# EAGLE board magarray_v1 (EAGLE 6.5.0), part 1 of 3
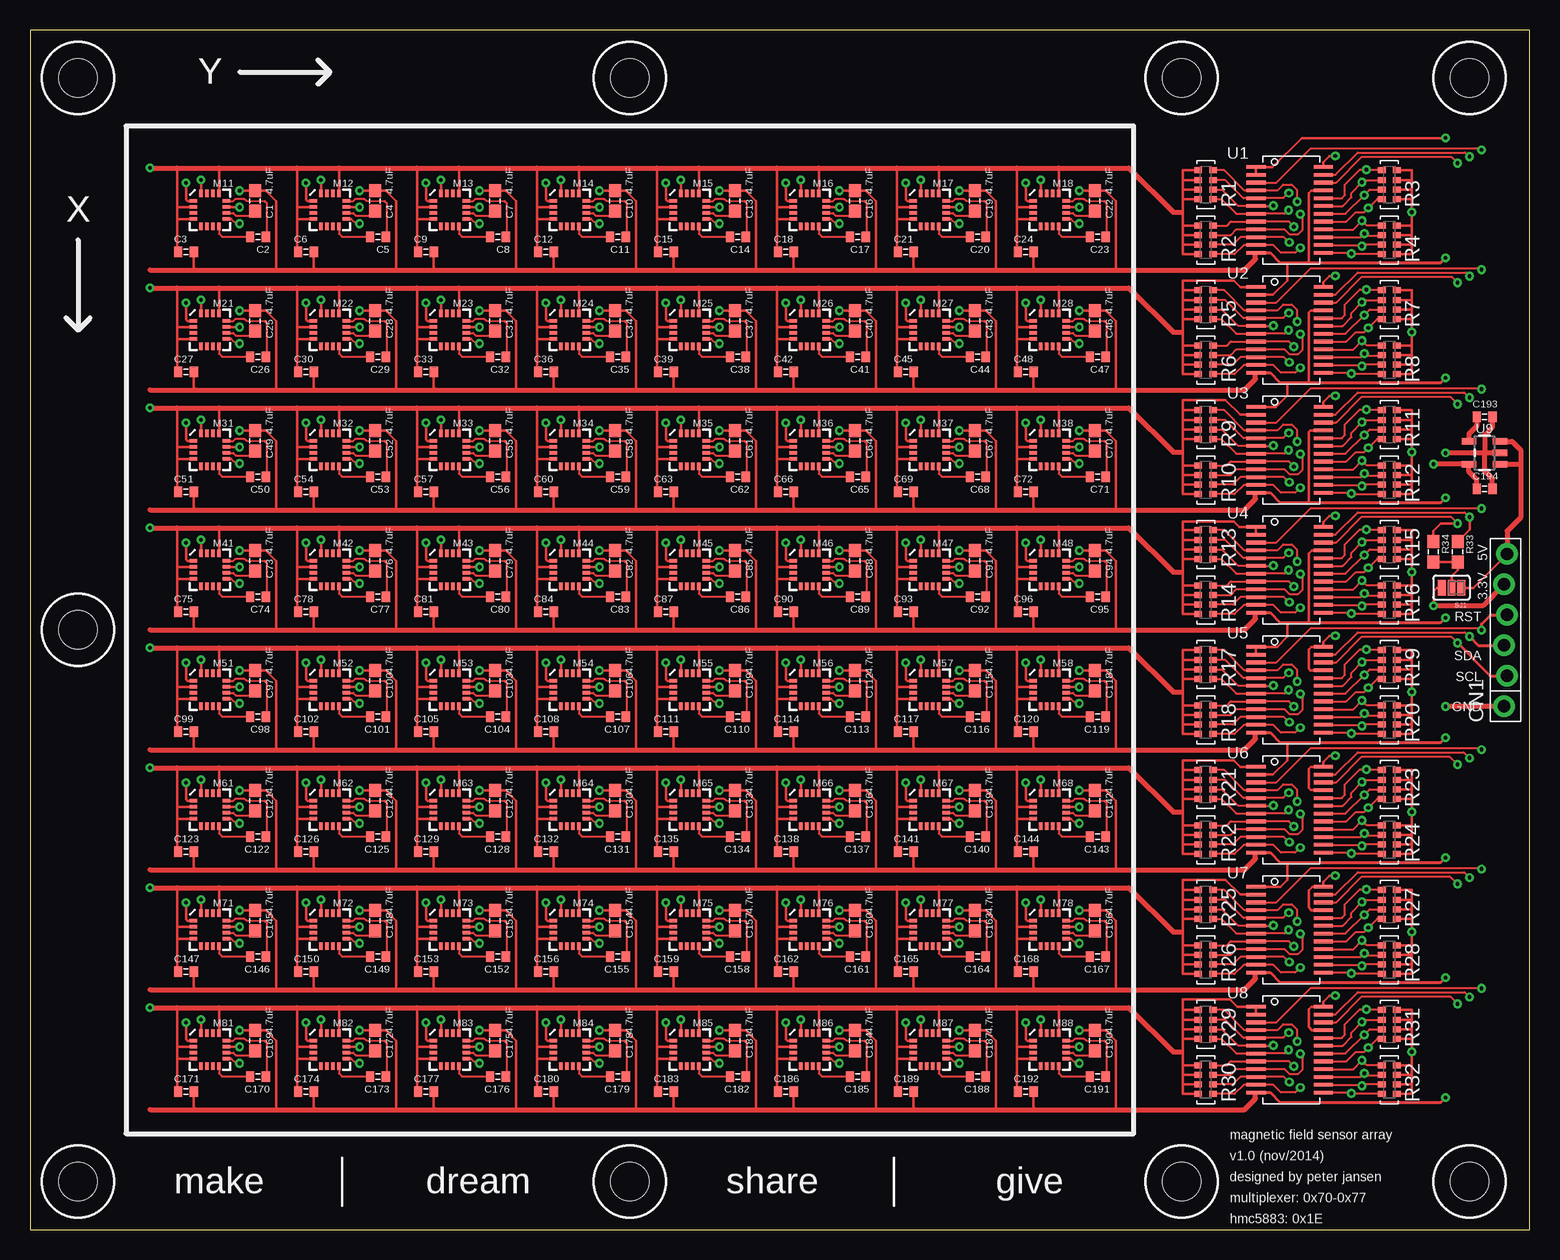
[diagram p5: board, top side]
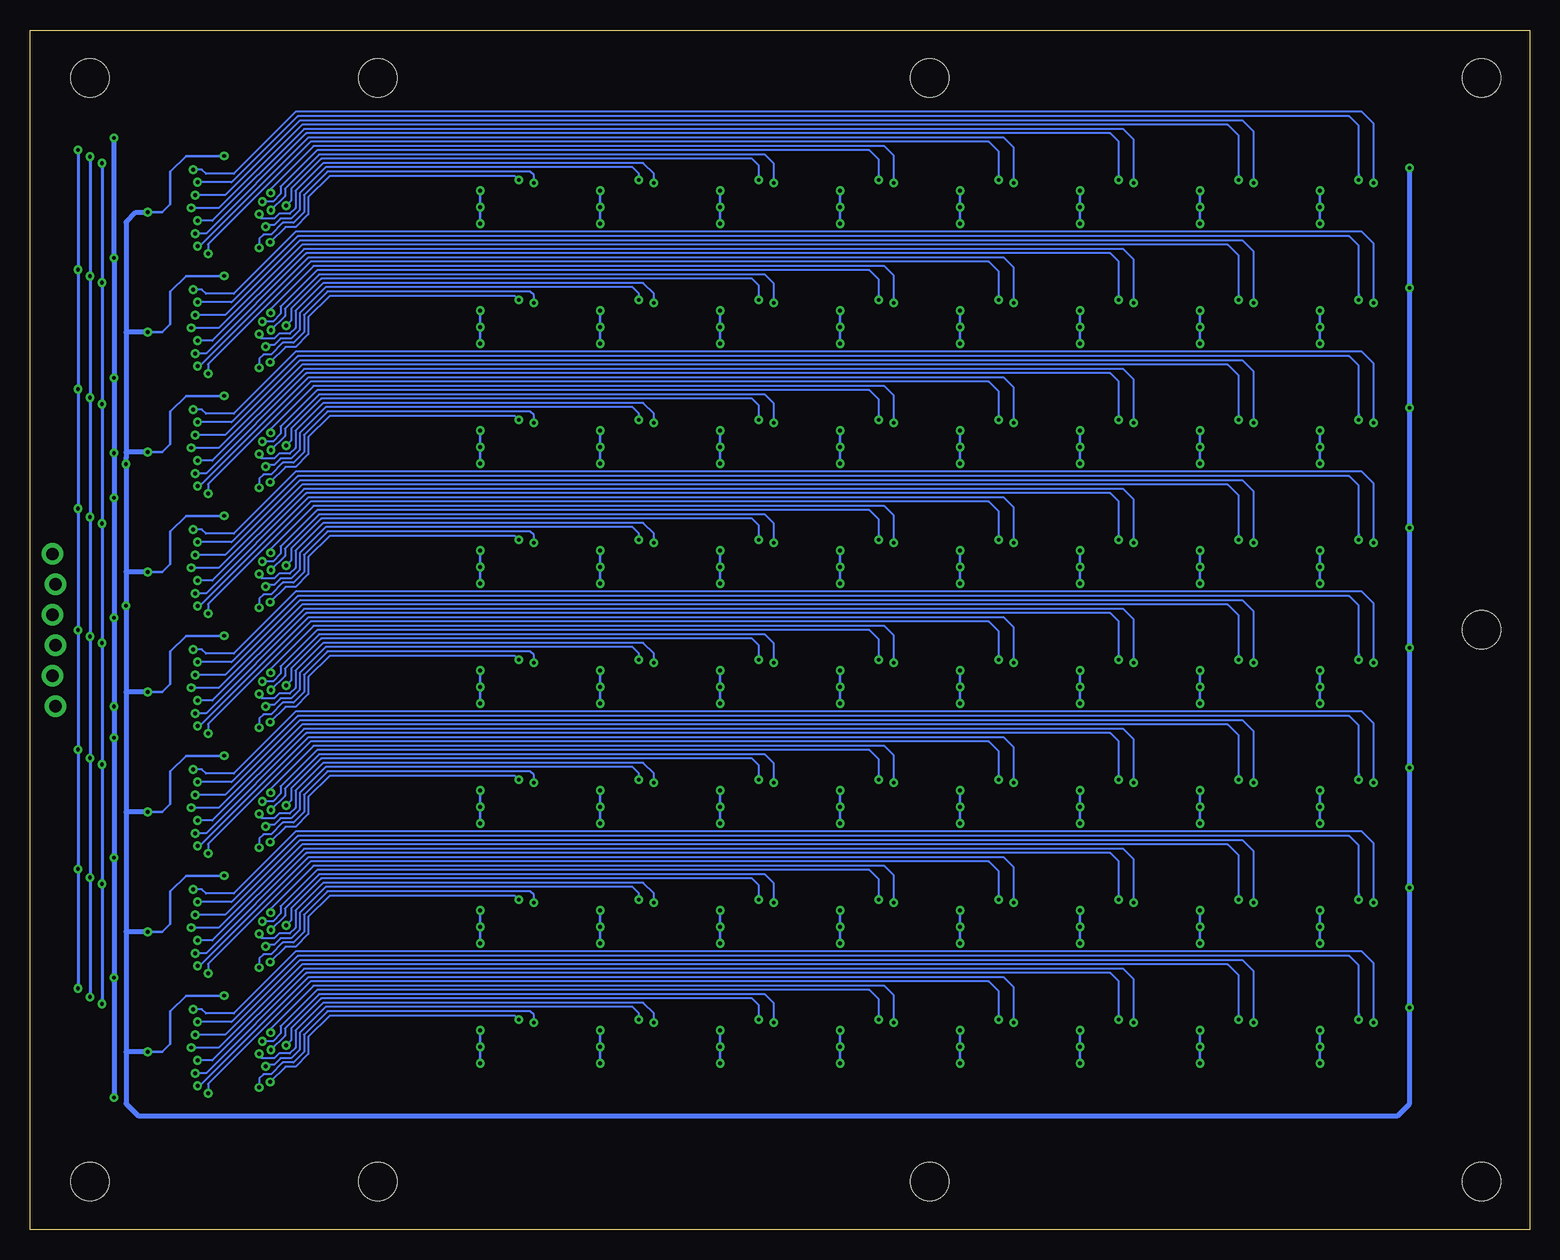
[diagram p6: board, bottom side, seen from below]

Size 125 x 100 mm. Coordinates in mm from the lower left corner, seen from the top.
Outline: 0,0 125,0 125,100 0,100 0,0
Copper layers (1*16): Top 0.035mm / dielectric 1.5mm / Bottom 0.035mm
Design rules "default *": minimum track width 7mil, minimum drill 13mil, track to track 7mil, track to pad 7mil, pad to pad 7mil, via to via 7mil, smd to smd 7mil, copper to edge 20mil, drill to drill 8mil, minimum pad ring 10mil, minimum via ring 8mil, stop-mask expansion 4mil, vias tented up to drill 13mil, thermal gap 10mil
Holes 3.2 mm at 4,96 4,4 96,4 96,96 120,96 120,4 4,50 50,4 50,96

## Footprints (pad centres in the part's own frame; a part is rotated, then mirrored left to right if it is on the bottom)
0603 = smd 1.1 x 1: 1 -0.85,0; 2 0.85,0
C0402 = smd 0.7 x 0.9: 1 -0.65,0; 2 0.65,0
1X06 = drill 1.016 pad 1.778: 1 0,0.127; 2 2.54,-0.127; 3 5.08,0.127; 4 7.62,-0.127; 5 10.16,0.127; 6 12.7,-0.127
16LPCC = smd 0.65 x 0.28: 1 -1.37,0.75; 2 -1.37,0.25; 3 -1.37,-0.25; 4 -1.37,-0.75; 9 1.37,-0.75; 10 1.37,-0.25; 11 1.37,0.25; 12 1.37,0.75 | smd 0.28 x 0.65: 5 -0.75,-1.37; 6 -0.25,-1.37; 7 0.25,-1.37; 8 0.75,-1.37; 13 0.75,1.37; 14 0.25,1.37; 15 -0.25,1.37; 16 -0.75,1.37
0603-ARV = smd 0.5 x 0.65: 1 -1.2,-0.625; 2 -0.4,-0.625; 3 0.4,-0.625; 4 1.2,-0.625; 5 1.2,0.625; 6 0.4,0.625; 7 -0.4,0.625; 8 -1.2,0.625
SJ_3_PASTE1&2 = smd 0.635 x 1.27: 1 -0.813,0; 2 0,0; 3 0.813,0
TSSOP-24-4.4MM = smd 0.3 x 1.6: 1 -3.575,-2.8; 2 -2.925,-2.8; 3 -2.275,-2.8; 4 -1.625,-2.8; 5 -0.975,-2.8; 6 -0.325,-2.8; 7 0.325,-2.8; 8 0.975,-2.8; 9 1.625,-2.8; 10 2.275,-2.8; 11 2.925,-2.8; 12 3.575,-2.8; 13 3.575,2.8; 14 2.925,2.8; 15 2.275,2.8; 16 1.625,2.8; 17 0.975,2.8; 18 0.325,2.8; 19 -0.325,2.8; 20 -0.975,2.8; 21 -1.625,2.8; 22 -2.275,2.8; 23 -2.925,2.8; 24 -3.575,2.8
SOT23-5 = smd 0.55 x 1.2: 1 -0.95,-1.3; 2 0,-1.3; 3 0.95,-1.3; 4 0.95,1.3; 5 -0.95,1.3

## Placement (x,y rotation side)
C1  4.7uF  [0603]  18.75,85.75 90 top
C2  0.22uF  [C0402]  19,82.75 180 top
C3  0.1uF  [C0402]  13,81.5 0 top
C4  4.7uF  [0603]  28.75,85.75 90 top
C5  0.22uF  [C0402]  29,82.75 180 top
C6  0.1uF  [C0402]  23,81.5 0 top
C7  4.7uF  [0603]  38.75,85.75 90 top
C8  0.22uF  [C0402]  39,82.75 180 top
C9  0.1uF  [C0402]  33,81.5 0 top
C10  4.7uF  [0603]  48.75,85.75 90 top
C11  0.22uF  [C0402]  49,82.75 180 top
C12  0.1uF  [C0402]  43,81.5 0 top
C13  4.7uF  [0603]  58.75,85.75 90 top
C14  0.22uF  [C0402]  59,82.75 180 top
C15  0.1uF  [C0402]  53,81.5 0 top
C16  4.7uF  [0603]  68.75,85.75 90 top
C17  0.22uF  [C0402]  69,82.75 180 top
C18  0.1uF  [C0402]  63,81.5 0 top
C19  4.7uF  [0603]  78.75,85.75 90 top
C20  0.22uF  [C0402]  79,82.75 180 top
C21  0.1uF  [C0402]  73,81.5 0 top
C22  4.7uF  [0603]  88.75,85.75 90 top
C23  0.22uF  [C0402]  89,82.75 180 top
C24  0.1uF  [C0402]  83,81.5 0 top
C25  4.7uF  [0603]  18.75,75.75 90 top
C26  0.22uF  [C0402]  19,72.75 180 top
C27  0.1uF  [C0402]  13,71.5 0 top
C28  4.7uF  [0603]  28.75,75.75 90 top
C29  0.22uF  [C0402]  29,72.75 180 top
C30  0.1uF  [C0402]  23,71.5 0 top
C31  4.7uF  [0603]  38.75,75.75 90 top
C32  0.22uF  [C0402]  39,72.75 180 top
C33  0.1uF  [C0402]  33,71.5 0 top
C34  4.7uF  [0603]  48.75,75.75 90 top
C35  0.22uF  [C0402]  49,72.75 180 top
C36  0.1uF  [C0402]  43,71.5 0 top
C37  4.7uF  [0603]  58.75,75.75 90 top
C38  0.22uF  [C0402]  59,72.75 180 top
C39  0.1uF  [C0402]  53,71.5 0 top
C40  4.7uF  [0603]  68.75,75.75 90 top
C41  0.22uF  [C0402]  69,72.75 180 top
C42  0.1uF  [C0402]  63,71.5 0 top
C43  4.7uF  [0603]  78.75,75.75 90 top
C44  0.22uF  [C0402]  79,72.75 180 top
C45  0.1uF  [C0402]  73,71.5 0 top
C46  4.7uF  [0603]  88.75,75.75 90 top
C47  0.22uF  [C0402]  89,72.75 180 top
C48  0.1uF  [C0402]  83,71.5 0 top
C49  4.7uF  [0603]  18.75,65.75 90 top
C50  0.22uF  [C0402]  19,62.75 180 top
C51  0.1uF  [C0402]  13,61.5 0 top
C52  4.7uF  [0603]  28.75,65.75 90 top
C53  0.22uF  [C0402]  29,62.75 180 top
C54  0.1uF  [C0402]  23,61.5 0 top
C55  4.7uF  [0603]  38.75,65.75 90 top
C56  0.22uF  [C0402]  39,62.75 180 top
C57  0.1uF  [C0402]  33,61.5 0 top
C58  4.7uF  [0603]  48.75,65.75 90 top
C59  0.22uF  [C0402]  49,62.75 180 top
C60  0.1uF  [C0402]  43,61.5 0 top
C61  4.7uF  [0603]  58.75,65.75 90 top
C62  0.22uF  [C0402]  59,62.75 180 top
C63  0.1uF  [C0402]  53,61.5 0 top
C64  4.7uF  [0603]  68.75,65.75 90 top
C65  0.22uF  [C0402]  69,62.75 180 top
C66  0.1uF  [C0402]  63,61.5 0 top
C67  4.7uF  [0603]  78.75,65.75 90 top
C68  0.22uF  [C0402]  79,62.75 180 top
C69  0.1uF  [C0402]  73,61.5 0 top
C70  4.7uF  [0603]  88.75,65.75 90 top
C71  0.22uF  [C0402]  89,62.75 180 top
C72  0.1uF  [C0402]  83,61.5 0 top
C73  4.7uF  [0603]  18.75,55.75 90 top
C74  0.22uF  [C0402]  19,52.75 180 top
C75  0.1uF  [C0402]  13,51.5 0 top
C76  4.7uF  [0603]  28.75,55.75 90 top
C77  0.22uF  [C0402]  29,52.75 180 top
C78  0.1uF  [C0402]  23,51.5 0 top
C79  4.7uF  [0603]  38.75,55.75 90 top
C80  0.22uF  [C0402]  39,52.75 180 top
C81  0.1uF  [C0402]  33,51.5 0 top
C82  4.7uF  [0603]  48.75,55.75 90 top
C83  0.22uF  [C0402]  49,52.75 180 top
C84  0.1uF  [C0402]  43,51.5 0 top
C85  4.7uF  [0603]  58.75,55.75 90 top
C86  0.22uF  [C0402]  59,52.75 180 top
C87  0.1uF  [C0402]  53,51.5 0 top
C88  4.7uF  [0603]  68.75,55.75 90 top
C89  0.22uF  [C0402]  69,52.75 180 top
C90  0.1uF  [C0402]  63,51.5 0 top
C91  4.7uF  [0603]  78.75,55.75 90 top
C92  0.22uF  [C0402]  79,52.75 180 top
C93  0.1uF  [C0402]  73,51.5 0 top
C94  4.7uF  [0603]  88.75,55.75 90 top
C95  0.22uF  [C0402]  89,52.75 180 top
C96  0.1uF  [C0402]  83,51.5 0 top
C97  4.7uF  [0603]  18.75,45.75 90 top
C98  0.22uF  [C0402]  19,42.75 180 top
C99  0.1uF  [C0402]  13,41.5 0 top
C100  4.7uF  [0603]  28.75,45.75 90 top
C101  0.22uF  [C0402]  29,42.75 180 top
C102  0.1uF  [C0402]  23,41.5 0 top
C103  4.7uF  [0603]  38.75,45.75 90 top
C104  0.22uF  [C0402]  39,42.75 180 top
C105  0.1uF  [C0402]  33,41.5 0 top
C106  4.7uF  [0603]  48.75,45.75 90 top
C107  0.22uF  [C0402]  49,42.75 180 top
C108  0.1uF  [C0402]  43,41.5 0 top
C109  4.7uF  [0603]  58.75,45.75 90 top
C110  0.22uF  [C0402]  59,42.75 180 top
C111  0.1uF  [C0402]  53,41.5 0 top
C112  4.7uF  [0603]  68.75,45.75 90 top
C113  0.22uF  [C0402]  69,42.75 180 top
C114  0.1uF  [C0402]  63,41.5 0 top
C115  4.7uF  [0603]  78.75,45.75 90 top
C116  0.22uF  [C0402]  79,42.75 180 top
C117  0.1uF  [C0402]  73,41.5 0 top
C118  4.7uF  [0603]  88.75,45.75 90 top
C119  0.22uF  [C0402]  89,42.75 180 top
C120  0.1uF  [C0402]  83,41.5 0 top
C121  4.7uF  [0603]  18.75,35.75 90 top
C122  0.22uF  [C0402]  19,32.75 180 top
C123  0.1uF  [C0402]  13,31.5 0 top
C124  4.7uF  [0603]  28.75,35.75 90 top
C125  0.22uF  [C0402]  29,32.75 180 top
C126  0.1uF  [C0402]  23,31.5 0 top
C127  4.7uF  [0603]  38.75,35.75 90 top
C128  0.22uF  [C0402]  39,32.75 180 top
C129  0.1uF  [C0402]  33,31.5 0 top
C130  4.7uF  [0603]  48.75,35.75 90 top
C131  0.22uF  [C0402]  49,32.75 180 top
C132  0.1uF  [C0402]  43,31.5 0 top
C133  4.7uF  [0603]  58.75,35.75 90 top
C134  0.22uF  [C0402]  59,32.75 180 top
C135  0.1uF  [C0402]  53,31.5 0 top
C136  4.7uF  [0603]  68.75,35.75 90 top
C137  0.22uF  [C0402]  69,32.75 180 top
C138  0.1uF  [C0402]  63,31.5 0 top
C139  4.7uF  [0603]  78.75,35.75 90 top
C140  0.22uF  [C0402]  79,32.75 180 top
C141  0.1uF  [C0402]  73,31.5 0 top
C142  4.7uF  [0603]  88.75,35.75 90 top
C143  0.22uF  [C0402]  89,32.75 180 top
C144  0.1uF  [C0402]  83,31.5 0 top
C145  4.7uF  [0603]  18.75,25.75 90 top
C146  0.22uF  [C0402]  19,22.75 180 top
C147  0.1uF  [C0402]  13,21.5 0 top
C148  4.7uF  [0603]  28.75,25.75 90 top
C149  0.22uF  [C0402]  29,22.75 180 top
C150  0.1uF  [C0402]  23,21.5 0 top
C151  4.7uF  [0603]  38.75,25.75 90 top
C152  0.22uF  [C0402]  39,22.75 180 top
C153  0.1uF  [C0402]  33,21.5 0 top
C154  4.7uF  [0603]  48.75,25.75 90 top
C155  0.22uF  [C0402]  49,22.75 180 top
C156  0.1uF  [C0402]  43,21.5 0 top
C157  4.7uF  [0603]  58.75,25.75 90 top
C158  0.22uF  [C0402]  59,22.75 180 top
C159  0.1uF  [C0402]  53,21.5 0 top
C160  4.7uF  [0603]  68.75,25.75 90 top
C161  0.22uF  [C0402]  69,22.75 180 top
C162  0.1uF  [C0402]  63,21.5 0 top
C163  4.7uF  [0603]  78.75,25.75 90 top
C164  0.22uF  [C0402]  79,22.75 180 top
C165  0.1uF  [C0402]  73,21.5 0 top
C166  4.7uF  [0603]  88.75,25.75 90 top
C167  0.22uF  [C0402]  89,22.75 180 top
C168  0.1uF  [C0402]  83,21.5 0 top
C169  4.7uF  [0603]  18.75,15.75 90 top
C170  0.22uF  [C0402]  19,12.75 180 top
C171  0.1uF  [C0402]  13,11.5 0 top
C172  4.7uF  [0603]  28.75,15.75 90 top
C173  0.22uF  [C0402]  29,12.75 180 top
C174  0.1uF  [C0402]  23,11.5 0 top
C175  4.7uF  [0603]  38.75,15.75 90 top
C176  0.22uF  [C0402]  39,12.75 180 top
C177  0.1uF  [C0402]  33,11.5 0 top
C178  4.7uF  [0603]  48.75,15.75 90 top
C179  0.22uF  [C0402]  49,12.75 180 top
C180  0.1uF  [C0402]  43,11.5 0 top
C181  4.7uF  [0603]  58.75,15.75 90 top
C182  0.22uF  [C0402]  59,12.75 180 top
C183  0.1uF  [C0402]  53,11.5 0 top
C184  4.7uF  [0603]  68.75,15.75 90 top
C185  0.22uF  [C0402]  69,12.75 180 top
C186  0.1uF  [C0402]  63,11.5 0 top
C187  4.7uF  [0603]  78.75,15.75 90 top
C188  0.22uF  [C0402]  79,12.75 180 top
C189  0.1uF  [C0402]  73,11.5 0 top
C190  4.7uF  [0603]  88.75,15.75 90 top
C191  0.22uF  [C0402]  89,12.75 180 top
C192  0.1uF  [C0402]  83,11.5 0 top
C193  470pF  [C0402]  121.25,67.75 0 top
C194  4.7uF  [C0402]  121.25,61.75 0 top
CN1  [1X06]  123,43.62 90 top
M11  HMC5883LSMD  [16LPCC]  15,85 0 top
M12  HMC5883LSMD  [16LPCC]  25,85 0 top
M13  HMC5883LSMD  [16LPCC]  35,85 0 top
M14  HMC5883LSMD  [16LPCC]  45,85 0 top
M15  HMC5883LSMD  [16LPCC]  55,85 0 top
M16  HMC5883LSMD  [16LPCC]  65,85 0 top
M17  HMC5883LSMD  [16LPCC]  75,85 0 top
M18  HMC5883LSMD  [16LPCC]  85,85 0 top
M21  HMC5883LSMD  [16LPCC]  15,75 0 top
M22  HMC5883LSMD  [16LPCC]  25,75 0 top
M23  HMC5883LSMD  [16LPCC]  35,75 0 top
M24  HMC5883LSMD  [16LPCC]  45,75 0 top
M25  HMC5883LSMD  [16LPCC]  55,75 0 top
M26  HMC5883LSMD  [16LPCC]  65,75 0 top
M27  HMC5883LSMD  [16LPCC]  75,75 0 top
M28  HMC5883LSMD  [16LPCC]  85,75 0 top
M31  HMC5883LSMD  [16LPCC]  15,65 0 top
M32  HMC5883LSMD  [16LPCC]  25,65 0 top
M33  HMC5883LSMD  [16LPCC]  35,65 0 top
M34  HMC5883LSMD  [16LPCC]  45,65 0 top
M35  HMC5883LSMD  [16LPCC]  55,65 0 top
M36  HMC5883LSMD  [16LPCC]  65,65 0 top
M37  HMC5883LSMD  [16LPCC]  75,65 0 top
M38  HMC5883LSMD  [16LPCC]  85,65 0 top
M41  HMC5883LSMD  [16LPCC]  15,55 0 top
M42  HMC5883LSMD  [16LPCC]  25,55 0 top
M43  HMC5883LSMD  [16LPCC]  35,55 0 top
M44  HMC5883LSMD  [16LPCC]  45,55 0 top
M45  HMC5883LSMD  [16LPCC]  55,55 0 top
M46  HMC5883LSMD  [16LPCC]  65,55 0 top
M47  HMC5883LSMD  [16LPCC]  75,55 0 top
M48  HMC5883LSMD  [16LPCC]  85,55 0 top
M51  HMC5883LSMD  [16LPCC]  15,45 0 top
M52  HMC5883LSMD  [16LPCC]  25,45 0 top
M53  HMC5883LSMD  [16LPCC]  35,45 0 top
M54  HMC5883LSMD  [16LPCC]  45,45 0 top
M55  HMC5883LSMD  [16LPCC]  55,45 0 top
M56  HMC5883LSMD  [16LPCC]  65,45 0 top
M57  HMC5883LSMD  [16LPCC]  75,45 0 top
M58  HMC5883LSMD  [16LPCC]  85,45 0 top
M61  HMC5883LSMD  [16LPCC]  15,35 0 top
M62  HMC5883LSMD  [16LPCC]  25,35 0 top
M63  HMC5883LSMD  [16LPCC]  35,35 0 top
M64  HMC5883LSMD  [16LPCC]  45,35 0 top
M65  HMC5883LSMD  [16LPCC]  55,35 0 top
M66  HMC5883LSMD  [16LPCC]  65,35 0 top
M67  HMC5883LSMD  [16LPCC]  75,35 0 top
M68  HMC5883LSMD  [16LPCC]  85,35 0 top
M71  HMC5883LSMD  [16LPCC]  15,25 0 top
M72  HMC5883LSMD  [16LPCC]  25,25 0 top
M73  HMC5883LSMD  [16LPCC]  35,25 0 top
M74  HMC5883LSMD  [16LPCC]  45,25 0 top
M75  HMC5883LSMD  [16LPCC]  55,25 0 top
M76  HMC5883LSMD  [16LPCC]  65,25 0 top
M77  HMC5883LSMD  [16LPCC]  75,25 0 top
M78  HMC5883LSMD  [16LPCC]  85,25 0 top
M81  HMC5883LSMD  [16LPCC]  15,15 0 top
M82  HMC5883LSMD  [16LPCC]  25,15 0 top
M83  HMC5883LSMD  [16LPCC]  35,15 0 top
M84  HMC5883LSMD  [16LPCC]  45,15 0 top
M85  HMC5883LSMD  [16LPCC]  55,15 0 top
M86  HMC5883LSMD  [16LPCC]  65,15 0 top
M87  HMC5883LSMD  [16LPCC]  75,15 0 top
M88  HMC5883LSMD  [16LPCC]  85,15 0 top
R1  [0603-ARV]  98,87.1 90 top
R2  [0603-ARV]  98,82.5 90 top
R3  [0603-ARV]  113.31,87.1 90 top
R4  [0603-ARV]  113.31,82.5 90 top
R5  [0603-ARV]  98,77.1 90 top
R6  [0603-ARV]  98,72.5 90 top
R7  [0603-ARV]  113.31,77.1 90 top
R8  [0603-ARV]  113.31,72.5 90 top
R9  [0603-ARV]  98,67.1 90 top
R10  [0603-ARV]  98,62.5 90 top
R11  [0603-ARV]  113.31,67.1 90 top
R12  [0603-ARV]  113.31,62.5 90 top
R13  [0603-ARV]  98,57.1 90 top
R14  [0603-ARV]  98,52.5 90 top
R15  [0603-ARV]  113.31,57.1 90 top
R16  [0603-ARV]  113.31,52.5 90 top
R17  [0603-ARV]  98,47.1 90 top
R18  [0603-ARV]  98,42.5 90 top
R19  [0603-ARV]  113.31,47.1 90 top
R20  [0603-ARV]  113.31,42.5 90 top
R21  [0603-ARV]  98,37.1 90 top
R22  [0603-ARV]  98,32.5 90 top
R23  [0603-ARV]  113.31,37.1 90 top
R24  [0603-ARV]  113.31,32.5 90 top
R25  [0603-ARV]  98,27.1 90 top
R26  [0603-ARV]  98,22.5 90 top
R27  [0603-ARV]  113.31,27.1 90 top
R28  [0603-ARV]  113.31,22.5 90 top
R29  [0603-ARV]  98,17.1 90 top
R30  [0603-ARV]  98,12.5 90 top
R31  [0603-ARV]  113.31,17.1 90 top
R32  [0603-ARV]  113.31,12.5 90 top
R33  [0603]  119,56.5 270 top
R34  [0603]  116.97,56.5 270 top
SJ1  [SJ_3_PASTE1&2]  118.5,53.5 180 top
U1  TCA9548A  [TSSOP-24-4.4MM]  105,85 270 top
U2  TCA9548A  [TSSOP-24-4.4MM]  105,75 270 top
U3  TCA9548A  [TSSOP-24-4.4MM]  105,65 270 top
U4  TCA9548A  [TSSOP-24-4.4MM]  105,55 270 top
U5  TCA9548A  [TSSOP-24-4.4MM]  105,45 270 top
U6  TCA9548A  [TSSOP-24-4.4MM]  105,35 270 top
U7  TCA9548A  [TSSOP-24-4.4MM]  105,25 270 top
U8  TCA9548A  [TSSOP-24-4.4MM]  105,15 270 top
U9  MIC5205-3.3YM5  [SOT23-5]  121.25,64.75 90 top

## Tracks (layer width: path | path; a pad name or v marks a point on that pad's centre or on a via)
3.3V  (via drill 0.33)
  Top 0.203: 12.26,84.28 12.26,85.24 | M11.4 12.28,84.25 12.26,84.28 | M11.2 12.27,85.25 12.26,85.24 | M11.13 15.75,88.5 | 22.26,84.28 22.26,85.24 | 22.26,85.24 22.26,88.49 22.25,88.5 | M12.4 22.28,84.25 22.26,84.28 | M12.2 22.27,85.25 22.26,85.24 | M12.13 25.75,88.5 | 32.26,84.28 32.26,85.24 | 32.26,85.24 32.26,88.49 32.25,88.5 | M13.4 32.28,84.25 32.26,84.28 | M13.2 32.27,85.25 32.26,85.24 | M13.13 35.75,88.5 | 42.26,84.28 42.26,85.24 | 42.26,85.24 42.26,88.49 42.25,88.5 | M14.4 42.28,84.25 42.26,84.28 | M14.2 42.27,85.25 42.26,85.24 | M14.13 45.75,88.5 | 52.26,84.28 52.26,85.24 | 52.26,85.24 52.26,88.49 52.25,88.5 | M15.4 52.28,84.25 52.26,84.28 | M15.2 52.27,85.25 52.26,85.24 | M15.13 55.75,88.5 | 62.26,84.28 62.26,85.24 | 62.26,85.24 62.26,88.49 62.25,88.5 | M16.4 62.28,84.25 62.26,84.28 | M16.2 62.27,85.25 62.26,85.24 | M16.13 65.75,88.5 | 72.26,84.28 72.26,85.24 | 72.26,85.24 72.26,88.49 72.25,88.5 | M17.4 72.28,84.25 72.26,84.28 | M17.2 72.27,85.25 72.26,85.24 | M17.13 75.75,88.5 | 82.26,84.28 82.26,85.24 | 82.26,85.24 82.26,88.49 82.25,88.5 | M18.4 82.28,84.25 82.26,84.28 | M18.2 82.27,85.25 82.26,85.24 | M18.13 85.75,88.5 | 12.26,84.28 12.26,81.59 C3.1 | 22.26,84.28 22.26,81.59 C6.1 | 32.26,84.28 32.26,81.59 C9.1 | 42.26,84.28 42.26,81.59 C12.1 | 52.26,84.28 52.26,81.59 C15.1 | 62.26,84.28 62.26,81.59 C18.1 | 72.26,84.28 72.26,81.59 C21.1 | 82.26,84.28 82.26,81.59 C24.1 | 12.26,85.24 12.26,88.49 12.25,88.5 | R3.4 115.2,88.3 115.2,87.5 | 115.2,87.5 115.2,86.7 | 115.2,86.7 115.2,85.9 | 115.2,85.9 v115.2,84.8 115.2,83.7 | 115.2,83.7 115.2,82.9 | 115.2,82.9 115.2,82.1 | 115.2,82.1 115.2,81.3 R4.1 | R4.2 115.2,82.1 | R4.3 115.2,82.9 | R4.4 115.2,83.7 | R3.1 115.2,85.9
  Top 0.203: R3.2 115.2,86.7 | R3.3 115.2,87.5 | U1.24 107.8,89 108.3,89.5 v108.8,89.5 | R1.5 96.1,88.3 96.1,87.5 | 96.1,87.5 96.1,86.7 | 96.1,86.7 96.1,85.9 | 96.1,85.9 96.1,84.8 | 96.1,84.8 96.1,83.7 | 96.1,83.7 96.1,82.9 | 96.1,82.9 96.1,82.1 | 96.1,82.1 96.1,81.3 R2.8 | R2.7 96.1,82.1 | R2.6 96.1,82.9 | R2.5 96.1,83.7 | R1.6 96.1,87.5 | R1.7 96.1,86.7 | R1.8 96.1,85.9 | 96,84.8 96.1,84.8 | 12.26,74.28 12.26,75.24 | M21.4 12.28,74.25 12.26,74.28 | M21.2 12.27,75.25 12.26,75.24 | M21.13 15.75,78.5 | 22.26,74.28 22.26,75.24 | 22.26,75.24 22.26,78.49 22.25,78.5 | M22.4 22.28,74.25 22.26,74.28 | M22.2 22.27,75.25 22.26,75.24 | M22.13 25.75,78.5 | 32.26,74.28 32.26,75.24 | 32.26,75.24 32.26,78.49 32.25,78.5 | M23.4 32.28,74.25 32.26,74.28 | M23.2 32.27,75.25 32.26,75.24 | M23.13 35.75,78.5 | 42.26,74.28 42.26,75.24 | 42.26,75.24 42.26,78.49 42.25,78.5 | M24.4 42.28,74.25 42.26,74.28 | M24.2 42.27,75.25 42.26,75.24 | M24.13 45.75,78.5 | 52.26,74.28 52.26,75.24 | 52.26,75.24 52.26,78.49 52.25,78.5 | M25.4 52.28,74.25 52.26,74.28 | M25.2 52.27,75.25 52.26,75.24 | M25.13 55.75,78.5 | 62.26,74.28 62.26,75.24 | 62.26,75.24 62.26,78.49 62.25,78.5 | M26.4 62.28,74.25 62.26,74.28 | M26.2 62.27,75.25 62.26,75.24 | M26.13 65.75,78.5 | 72.26,74.28 72.26,75.24 | 72.26,75.24 72.26,78.49 72.25,78.5 | M27.4 72.28,74.25 72.26,74.28 | M27.2 72.27,75.25 72.26,75.24 | M27.13 75.75,78.5 | 82.26,74.28 82.26,75.24 | 82.26,75.24 82.26,78.49 82.25,78.5 | M28.4 82.28,74.25 82.26,74.28 | M28.2 82.27,75.25 82.26,75.24 | M28.13 85.75,78.5 | 12.26,74.28 12.26,71.59 C27.1 | 22.26,74.28 22.26,71.59 C30.1 | 32.26,74.28 32.26,71.59 C33.1 | 42.26,74.28 42.26,71.59 C36.1 | 52.26,74.28 52.26,71.59 C39.1 | 62.26,74.28 62.26,71.59 C42.1
  Top 0.203: 72.26,74.28 72.26,71.59 C45.1 | 82.26,74.28 82.26,71.59 C48.1 | 12.26,75.24 12.26,78.49 12.25,78.5 | R7.4 115.2,78.3 115.2,77.5 | 115.2,77.5 115.2,76.7 | 115.2,76.7 115.2,75.9 | 115.2,75.9 v115.2,74.8 115.2,73.7 | 115.2,73.7 115.2,72.9 | 115.2,72.9 115.2,72.1 | 115.2,72.1 115.2,71.3 R8.1 | R8.2 115.2,72.1 | R8.3 115.2,72.9 | R8.4 115.2,73.7 | R7.1 115.2,75.9 | R7.2 115.2,76.7 | R7.3 115.2,77.5 | U2.24 107.8,79 108.3,79.5 v108.8,79.5 | R5.5 96.1,78.3 | 96.1,78.3 96.1,77.5 | 96.1,77.5 96.1,76.7 | 96.1,76.7 96.1,75.9 | 96.1,75.9 96.1,74.8 | 96.1,74.8 96.1,73.7 | 96.1,73.7 96.1,72.9 | 96.1,72.9 96.1,72.1 | 96.1,72.1 96.1,71.3 R6.8 | R6.7 96.1,72.1 | R6.6 96.1,72.9 | R6.5 96.1,73.7 | R5.6 96.1,77.5 | R5.7 96.1,76.7 | R5.8 96.1,75.9 | 96,74.8 96.1,74.8 | 12.26,64.28 12.26,65.24 | M31.4 12.28,64.25 12.26,64.28 | M31.2 12.27,65.25 12.26,65.24 | M31.13 15.75,68.5 | 22.26,64.28 22.26,65.24 | 22.26,65.24 22.26,68.49 22.25,68.5 | M32.4 22.28,64.25 22.26,64.28 | M32.2 22.27,65.25 22.26,65.24 | M32.13 25.75,68.5 | 32.26,64.28 32.26,65.24 | 32.26,65.24 32.26,68.49 32.25,68.5 | M33.4 32.28,64.25 32.26,64.28 | M33.2 32.27,65.25 32.26,65.24 | M33.13 35.75,68.5 | 42.26,64.28 42.26,65.24 | 42.26,65.24 42.26,68.49 42.25,68.5 | M34.4 42.28,64.25 42.26,64.28 | M34.2 42.27,65.25 42.26,65.24 | M34.13 45.75,68.5 | 52.26,64.28 52.26,65.24 | 52.26,65.24 52.26,68.49 52.25,68.5 | M35.4 52.28,64.25 52.26,64.28 | M35.2 52.27,65.25 52.26,65.24 | M35.13 55.75,68.5 | 62.26,64.28 62.26,65.24 | 62.26,65.24 62.26,68.49 62.25,68.5 | M36.4 62.28,64.25 62.26,64.28 | M36.2 62.27,65.25 62.26,65.24 | M36.13 65.75,68.5 | 72.26,64.28 72.26,65.24 | 72.26,65.24 72.26,68.49 72.25,68.5 | M37.4 72.28,64.25 72.26,64.28
  Top 0.203: M37.2 72.27,65.25 72.26,65.24 | M37.13 75.75,68.5 | 82.26,64.28 82.26,65.24 | 82.26,65.24 82.26,68.49 82.25,68.5 | M38.4 82.28,64.25 82.26,64.28 | M38.2 82.27,65.25 82.26,65.24 | M38.13 85.75,68.5 | 12.26,64.28 12.26,61.59 C51.1 | 22.26,64.28 22.26,61.59 C54.1 | 32.26,64.28 32.26,61.59 C57.1 | 42.26,64.28 42.26,61.59 C60.1 | 52.26,64.28 52.26,61.59 C63.1 | 62.26,64.28 62.26,61.59 C66.1 | 72.26,64.28 72.26,61.59 C69.1 | 82.26,64.28 82.26,61.59 C72.1 | 12.26,65.24 12.26,68.49 12.25,68.5 | R11.4 115.2,68.3 115.2,67.5 | 115.2,67.5 115.2,66.7 | 115.2,66.7 115.2,65.9 | 115.2,65.9 v115.2,64.8 115.2,63.7 | 115.2,63.7 115.2,62.9 | 115.2,62.9 115.2,62.1 | 115.2,62.1 115.2,61.3 R12.1 | R12.2 115.2,62.1 | R12.3 115.2,62.9 | R12.4 115.2,63.7 | R11.1 115.2,65.9 | R11.2 115.2,66.7 | R11.3 115.2,67.5 | U3.24 107.8,69 108.3,69.5 v108.8,69.5 | R9.5 96.1,68.3 | 96.1,68.3 96.1,67.5 | 96.1,67.5 96.1,66.7 | 96.1,66.7 96.1,65.9 | 96.1,65.9 96.1,64.8 | 96.1,64.8 96.1,63.7 | 96.1,63.7 96.1,62.9 | 96.1,62.9 96.1,62.1 | 96.1,62.1 96.1,61.3 R10.8 | R10.7 96.1,62.1 | R10.6 96.1,62.9 | R10.5 96.1,63.7 | R9.6 96.1,67.5 | R9.7 96.1,66.7 | R9.8 96.1,65.9 | 96,64.8 96.1,64.8 | 12.26,54.28 12.26,55.24 | M41.4 12.28,54.25 12.26,54.28 | M41.2 12.27,55.25 12.26,55.24 | M41.13 15.75,58.5 | 22.26,54.28 22.26,55.24 | 22.26,55.24 22.26,58.49 22.25,58.5 | M42.4 22.28,54.25 22.26,54.28 | M42.2 22.27,55.25 22.26,55.24 | M42.13 25.75,58.5 | 32.26,54.28 32.26,55.24 | 32.26,55.24 32.26,58.49 32.25,58.5 | M43.4 32.28,54.25 32.26,54.28 | M43.2 32.27,55.25 32.26,55.24 | M43.13 35.75,58.5 | 42.26,54.28 42.26,55.24 | 42.26,55.24 42.26,58.49 42.25,58.5 | M44.4 42.28,54.25 42.26,54.28 | M44.2 42.27,55.25 42.26,55.24
  Top 0.203: M44.13 45.75,58.5 | 52.26,54.28 52.26,55.24 | 52.26,55.24 52.26,58.49 52.25,58.5 | M45.4 52.28,54.25 52.26,54.28 | M45.2 52.27,55.25 52.26,55.24 | M45.13 55.75,58.5 | 62.26,54.28 62.26,55.24 | 62.26,55.24 62.26,58.49 62.25,58.5 | M46.4 62.28,54.25 62.26,54.28 | M46.2 62.27,55.25 62.26,55.24 | M46.13 65.75,58.5 | 72.26,54.28 72.26,55.24 | 72.26,55.24 72.26,58.49 72.25,58.5 | M47.4 72.28,54.25 72.26,54.28 | M47.2 72.27,55.25 72.26,55.24 | M47.13 75.75,58.5 | 82.26,54.28 82.26,55.24 | 82.26,55.24 82.26,58.49 82.25,58.5 | M48.4 82.28,54.25 82.26,54.28 | M48.2 82.27,55.25 82.26,55.24 | M48.13 85.75,58.5 | 12.26,54.28 12.26,51.59 C75.1 | 22.26,54.28 22.26,51.59 C78.1 | 32.26,54.28 32.26,51.59 C81.1 | 42.26,54.28 42.26,51.59 C84.1 | 52.26,54.28 52.26,51.59 C87.1 | 62.26,54.28 62.26,51.59 C90.1 | 72.26,54.28 72.26,51.59 C93.1 | 82.26,54.28 82.26,51.59 C96.1 | 12.26,55.24 12.26,58.49 12.25,58.5 | R15.4 115.2,58.3 115.2,57.5 | 115.2,57.5 115.2,56.7 | 115.2,56.7 115.2,55.9 | 115.2,55.9 v115.2,54.8 115.2,53.7 | 115.2,53.7 115.2,52.9 | 115.2,52.9 115.2,52.1 | 115.2,52.1 115.2,51.3 R16.1 | R16.2 115.2,52.1 | R16.3 115.2,52.9 | R16.4 115.2,53.7 | R15.1 115.2,55.9 | R15.2 115.2,56.7 | R15.3 115.2,57.5 | U4.24 107.8,59 108.3,59.5 v108.8,59.5 | R13.5 96.1,58.3 | 96.1,58.3 96.1,57.5 | 96.1,57.5 96.1,56.7 | 96.1,56.7 96.1,55.9 | 96.1,55.9 96.1,54.8 | 96.1,54.8 96.1,53.7 | 96.1,53.7 96.1,52.9 | 96.1,52.9 96.1,52.1 | 96.1,52.1 96.1,51.3 R14.8 | R14.7 96.1,52.1 | R14.6 96.1,52.9 | R14.5 96.1,53.7 | R13.6 96.1,57.5 | R13.7 96.1,56.7 | R13.8 96.1,55.9 | 96,54.8 96.1,54.8 | 12.26,44.28 12.26,45.24 | M51.4 12.28,44.25 12.26,44.28 | M51.2 12.27,45.25 12.26,45.24 | M51.13 15.75,48.5 | 22.26,44.28 22.26,45.24
  Top 0.203: 22.26,45.24 22.26,48.49 22.25,48.5 | M52.4 22.28,44.25 22.26,44.28 | M52.2 22.27,45.25 22.26,45.24 | M52.13 25.75,48.5 | 32.26,44.28 32.26,45.24 | 32.26,45.24 32.26,48.49 32.25,48.5 | M53.4 32.28,44.25 32.26,44.28 | M53.2 32.27,45.25 32.26,45.24 | M53.13 35.75,48.5 | 42.26,44.28 42.26,45.24 | 42.26,45.24 42.26,48.49 42.25,48.5 | M54.4 42.28,44.25 42.26,44.28 | M54.2 42.27,45.25 42.26,45.24 | M54.13 45.75,48.5 | 52.26,44.28 52.26,45.24 | 52.26,45.24 52.26,48.49 52.25,48.5 | M55.4 52.28,44.25 52.26,44.28 | M55.2 52.27,45.25 52.26,45.24 | M55.13 55.75,48.5 | 62.26,44.28 62.26,45.24 | 62.26,45.24 62.26,48.49 62.25,48.5 | M56.4 62.28,44.25 62.26,44.28 | M56.2 62.27,45.25 62.26,45.24 | M56.13 65.75,48.5 | 72.26,44.28 72.26,45.24 | 72.26,45.24 72.26,48.49 72.25,48.5 | M57.4 72.28,44.25 72.26,44.28 | M57.2 72.27,45.25 72.26,45.24 | M57.13 75.75,48.5 | 82.26,44.28 82.26,45.24 | 82.26,45.24 82.26,48.49 82.25,48.5 | M58.4 82.28,44.25 82.26,44.28 | M58.2 82.27,45.25 82.26,45.24 | M58.13 85.75,48.5 | 12.26,44.28 12.26,41.59 C99.1 | 22.26,44.28 22.26,41.59 C102.1 | 32.26,44.28 32.26,41.59 C105.1 | 42.26,44.28 42.26,41.59 C108.1 | 52.26,44.28 52.26,41.59 C111.1 | 62.26,44.28 62.26,41.59 C114.1 | 72.26,44.28 72.26,41.59 C117.1 | 82.26,44.28 82.26,41.59 C120.1 | 12.26,45.24 12.26,48.49 12.25,48.5 | R19.4 115.2,48.3 115.2,47.5 | 115.2,47.5 115.2,46.7 | 115.2,46.7 115.2,45.9 | 115.2,45.9 v115.2,44.8 115.2,43.7 | 115.2,43.7 115.2,42.9 | 115.2,42.9 115.2,42.1 | 115.2,42.1 115.2,41.3 R20.1 | R20.2 115.2,42.1 | R20.3 115.2,42.9 | R20.4 115.2,43.7 | R19.1 115.2,45.9 | R19.2 115.2,46.7 | R19.3 115.2,47.5 | v108.8,49.5 108.3,49.5 107.8,49 U5.24 106.81,48.58 106.59,48.36 106.59,46.76 106.73,46.62 U5.21
  Top 0.203: R17.5 96.1,48.3 96.1,47.5 | 96.1,47.5 96.1,46.7 | 96.1,46.7 96.1,45.9 | 96.1,45.9 96.1,44.8 | 96.1,44.8 96.1,43.7 | 96.1,43.7 96.1,42.9 | 96.1,42.9 96.1,42.1 | 96.1,42.1 96.1,41.3 R18.8 | R18.7 96.1,42.1 | R18.6 96.1,42.9 | R18.5 96.1,43.7 | R17.6 96.1,47.5 | R17.7 96.1,46.7 | R17.8 96.1,45.9 | 96,44.8 96.1,44.8 | 12.26,34.28 12.26,35.24 | M61.4 12.28,34.25 12.26,34.28 | M61.2 12.27,35.25 12.26,35.24 | M61.13 15.75,38.5 | 22.26,34.28 22.26,35.24 | 22.26,35.24 22.26,38.49 22.25,38.5 | M62.4 22.28,34.25 22.26,34.28 | M62.2 22.27,35.25 22.26,35.24 | M62.13 25.75,38.5 | 32.26,34.28 32.26,35.24 | 32.26,35.24 32.26,38.49 32.25,38.5 | M63.4 32.28,34.25 32.26,34.28 | M63.2 32.27,35.25 32.26,35.24 | M63.13 35.75,38.5 | 42.26,34.28 42.26,35.24 | 42.26,35.24 42.26,38.49 42.25,38.5 | M64.4 42.28,34.25 42.26,34.28 | M64.2 42.27,35.25 42.26,35.24 | M64.13 45.75,38.5 | 52.26,34.28 52.26,35.24 | 52.26,35.24 52.26,38.49 52.25,38.5 | M65.4 52.28,34.25 52.26,34.28 | M65.2 52.27,35.25 52.26,35.24 | M65.13 55.75,38.5 | 62.26,34.28 62.26,35.24 | 62.26,35.24 62.26,38.49 62.25,38.5 | M66.4 62.28,34.25 62.26,34.28 | M66.2 62.27,35.25 62.26,35.24 | M66.13 65.75,38.5 | 72.26,34.28 72.26,35.24 | 72.26,35.24 72.26,38.49 72.25,38.5 | M67.4 72.28,34.25 72.26,34.28 | M67.2 72.27,35.25 72.26,35.24 | M67.13 75.75,38.5 | 82.26,34.28 82.26,35.24 | 82.26,35.24 82.26,38.49 82.25,38.5 | M68.4 82.28,34.25 82.26,34.28 | M68.2 82.27,35.25 82.26,35.24 | M68.13 85.75,38.5 | 12.26,34.28 12.26,31.59 C123.1 | 22.26,34.28 22.26,31.59 C126.1 | 32.26,34.28 32.26,31.59 C129.1 | 42.26,34.28 42.26,31.59 C132.1 | 52.26,34.28 52.26,31.59 C135.1 | 62.26,34.28 62.26,31.59 C138.1 | 72.26,34.28 72.26,31.59 C141.1
  Top 0.203: 82.26,34.28 82.26,31.59 C144.1 | 12.26,35.24 12.26,38.49 12.25,38.5 | R23.4 115.2,38.3 115.2,37.5 | 115.2,37.5 115.2,36.7 | 115.2,36.7 115.2,35.9 | 115.2,35.9 v115.2,34.8 115.2,33.7 | 115.2,33.7 115.2,32.9 | 115.2,32.9 115.2,32.1 | 115.2,32.1 115.2,31.3 R24.1 | R24.2 115.2,32.1 | R24.3 115.2,32.9 | R24.4 115.2,33.7 | R23.1 115.2,35.9 | R23.2 115.2,36.7 | R23.3 115.2,37.5 | v108.8,39.5 108.3,39.5 107.8,39 U6.24 106.76,38.58 106.59,38.41 106.59,36.8 106.77,36.63 U6.21 | R21.5 96.1,38.3 | 96.1,38.3 96.1,37.5 | 96.1,37.5 96.1,36.7 | 96.1,36.7 96.1,35.9 | 96.1,35.9 96.1,34.8 | 96.1,34.8 96.1,33.7 | 96.1,33.7 96.1,32.9 | 96.1,32.9 96.1,32.1 | 96.1,32.1 96.1,31.3 R22.8 | R22.7 96.1,32.1 | R22.6 96.1,32.9 | R22.5 96.1,33.7 | R21.6 96.1,37.5 | R21.7 96.1,36.7 | R21.8 96.1,35.9 | 96,34.8 96.1,34.8 | 12.26,24.28 12.26,25.24 | M71.4 12.28,24.25 12.26,24.28 | M71.2 12.27,25.25 12.26,25.24 | M71.13 15.75,28.5 | 22.26,24.28 22.26,25.24 | 22.26,25.24 22.26,28.49 22.25,28.5 | M72.4 22.28,24.25 22.26,24.28 | M72.2 22.27,25.25 22.26,25.24 | M72.13 25.75,28.5 | 32.26,24.28 32.26,25.24 | 32.26,25.24 32.26,28.49 32.25,28.5 | M73.4 32.28,24.25 32.26,24.28 | M73.2 32.27,25.25 32.26,25.24 | M73.13 35.75,28.5 | 42.26,24.28 42.26,25.24 | 42.26,25.24 42.26,28.49 42.25,28.5 | M74.4 42.28,24.25 42.26,24.28 | M74.2 42.27,25.25 42.26,25.24 | M74.13 45.75,28.5 | 52.26,24.28 52.26,25.24 | 52.26,25.24 52.26,28.49 52.25,28.5 | M75.4 52.28,24.25 52.26,24.28 | M75.2 52.27,25.25 52.26,25.24 | M75.13 55.75,28.5 | 62.26,24.28 62.26,25.24 | 62.26,25.24 62.26,28.49 62.25,28.5 | M76.4 62.28,24.25 62.26,24.28 | M76.2 62.27,25.25 62.26,25.24 | M76.13 65.75,28.5 | 72.26,24.28 72.26,25.24 | 72.26,25.24 72.26,28.49 72.25,28.5
  Top 0.203: M77.4 72.28,24.25 72.26,24.28 | M77.2 72.27,25.25 72.26,25.24 | M77.13 75.75,28.5 | 82.26,24.28 82.26,25.24 | 82.26,25.24 82.26,28.49 82.25,28.5 | M78.4 82.28,24.25 82.26,24.28 | M78.2 82.27,25.25 82.26,25.24 | M78.13 85.75,28.5 | 12.26,24.28 12.26,21.59 C147.1 | 22.26,24.28 22.26,21.59 C150.1 | 32.26,24.28 32.26,21.59 C153.1 | 42.26,24.28 42.26,21.59 C156.1 | 52.26,24.28 52.26,21.59 C159.1 | 62.26,24.28 62.26,21.59 C162.1 | 72.26,24.28 72.26,21.59 C165.1 | 82.26,24.28 82.26,21.59 C168.1 | 12.26,25.24 12.26,28.49 12.25,28.5 | R27.4 115.2,28.3 115.2,27.5 | 115.2,27.5 115.2,26.7 | 115.2,26.7 115.2,25.9 | 115.2,25.9 v115.2,24.8 115.2,23.7 | 115.2,23.7 115.2,22.9 | 115.2,22.9 115.2,22.1 | 115.2,22.1 115.2,21.3 R28.1 | R28.2 115.2,22.1 | R28.3 115.2,22.9 | R28.4 115.2,23.7 | R27.1 115.2,25.9 | R27.2 115.2,26.7 | R27.3 115.2,27.5 | v108.8,29.5 108.3,29.5 107.8,29 U7.24 106.9,28.57 106.59,28.27 106.59,26.85 106.82,26.62 U7.21 | R25.5 96.1,28.3 | 96.1,28.3 96.1,27.5 | 96.1,27.5 96.1,26.7 | 96.1,26.7 96.1,25.9 | 96.1,25.9 96.1,24.8 | 96.1,24.8 96.1,23.7 | 96.1,23.7 96.1,22.9 | 96.1,22.9 96.1,22.1 | 96.1,22.1 96.1,21.3 R26.8 | R26.7 96.1,22.1 | R26.6 96.1,22.9 | R26.5 96.1,23.7 | R25.6 96.1,27.5 | R25.7 96.1,26.7 | R25.8 96.1,25.9 | 96,24.8 96.1,24.8 | 12.26,14.28 12.26,15.24 | M81.4 12.28,14.25 12.26,14.28 | M81.2 12.27,15.25 12.26,15.24 | M81.13 15.75,18.5 | 22.26,14.28 22.26,15.24 | 22.26,15.24 22.26,18.49 22.25,18.5 | M82.4 22.28,14.25 22.26,14.28 | M82.2 22.27,15.25 22.26,15.24 | M82.13 25.75,18.5 | 32.26,14.28 32.26,15.24 | 32.26,15.24 32.26,18.49 32.25,18.5 | M83.4 32.28,14.25 32.26,14.28 | M83.2 32.27,15.25 32.26,15.24 | M83.13 35.75,18.5 | 42.26,14.28 42.26,15.24
  Top 0.203: 42.26,15.24 42.26,18.49 42.25,18.5 | M84.4 42.28,14.25 42.26,14.28 | M84.2 42.27,15.25 42.26,15.24 | M84.13 45.75,18.5 | 52.26,14.28 52.26,15.24 | 52.26,15.24 52.26,18.49 52.25,18.5 | M85.4 52.28,14.25 52.26,14.28 | M85.2 52.27,15.25 52.26,15.24 | M85.13 55.75,18.5 | 62.26,14.28 62.26,15.24 | 62.26,15.24 62.26,18.49 62.25,18.5 | M86.4 62.28,14.25 62.26,14.28 | M86.2 62.27,15.25 62.26,15.24 | M86.13 65.75,18.5 | 72.26,14.28 72.26,15.24 | 72.26,15.24 72.26,18.49 72.25,18.5 | M87.4 72.28,14.25 72.26,14.28 | M87.2 72.27,15.25 72.26,15.24 | M87.13 75.75,18.5 | 82.26,14.28 82.26,15.24 | 82.26,15.24 82.26,18.49 82.25,18.5 | M88.4 82.28,14.25 82.26,14.28 | M88.2 82.27,15.25 82.26,15.24 | M88.13 85.75,18.5 | 12.26,14.28 12.26,11.59 C171.1 | 22.26,14.28 22.26,11.59 C174.1 | 32.26,14.28 32.26,11.59 C177.1 | 42.26,14.28 42.26,11.59 C180.1 | 52.26,14.28 52.26,11.59 C183.1 | 62.26,14.28 62.26,11.59 C186.1 | 72.26,14.28 72.26,11.59 C189.1 | 82.26,14.28 82.26,11.59 C192.1 | 12.26,15.24 12.26,18.49 12.25,18.5 | R31.4 115.2,18.3 115.2,17.5 | 115.2,17.5 115.2,16.7 | 115.2,16.7 115.2,15.9 | 115.2,15.9 v115.2,14.8 115.2,13.7 | 115.2,13.7 115.2,12.9 | 115.2,12.9 115.2,12.1 | 115.2,12.1 115.2,11.3 R32.1 | R32.2 115.2,12.1 | R32.3 115.2,12.9 | R32.4 115.2,13.7 | R31.1 115.2,15.9 | R31.2 115.2,16.7 | R31.3 115.2,17.5 | v108.8,19.5 108.3,19.5 107.8,19 U8.24 106.8,18.57 106.59,18.37 106.59,16.89 106.86,16.62 U8.21 | R29.5 96.1,18.3 | 96.1,18.3 96.1,17.5 | 96.1,17.5 96.1,16.7 | 96.1,16.7 96.1,15.9 | 96.1,15.9 96.1,14.8 | 96.1,14.8 96.1,13.7 | 96.1,13.7 96.1,12.9 | 96.1,12.9 96.1,12.1 | 96.1,12.1 96.1,11.3 R30.8 | R30.7 96.1,12.1 | R30.6 96.1,12.9 | R30.5 96.1,13.7 | R29.6 96.1,17.5
  Top 0.203: R29.7 96.1,16.7 | R29.8 96.1,15.9 | 96,14.8 96.1,14.8 | SJ1.3 117.25,53.5 117,53.25 v117,52 | U2.1 100.92,78.58 100.37,79.12 96.1,79.12 96.1,78.3 | U3.2 100.9,67.92 99.66,69.16 96.1,69.16 96.1,68.3 | U4.2 U4.1 100.83,58.58 100.37,59.03 96.1,59.03 96.1,58.3 | U6.1 100.91,38.58 100.37,39.12 96.1,39.12 96.1,39.11 96.1,38.3 | U7.2 100.89,27.93 99.66,29.16 96.1,29.16 96.1,28.98 96.1,28.3 | U8.2 U8.1 100.64,18.57 100.02,19.2 96.1,19.2 96.1,18.3
  Top 0.406: v10,88.5 12.25,88.5 15.75,88.5 22.25,88.5 25.75,88.5 32.25,88.5 35.75,88.5 42.25,88.5 45.75,88.5 52.25,88.5 55.75,88.5 62.25,88.5 65.75,88.5 72.25,88.5 75.75,88.5 82.25,88.5 85.75,88.5 91.6,88.5 95.3,84.8 96,84.8 | v10,78.5 12.25,78.5 15.75,78.5 22.25,78.5 25.75,78.5 32.25,78.5 35.75,78.5 42.25,78.5 45.75,78.5 52.25,78.5 55.75,78.5 62.25,78.5 65.75,78.5 72.25,78.5 75.75,78.5 82.25,78.5 85.75,78.5 91.6,78.5 95.3,74.8 96,74.8 | v10,68.5 12.25,68.5 15.75,68.5 22.25,68.5 25.75,68.5 32.25,68.5 35.75,68.5 42.25,68.5 45.75,68.5 52.25,68.5 55.75,68.5 62.25,68.5 65.75,68.5 72.25,68.5 75.75,68.5 82.25,68.5 85.75,68.5 91.6,68.5 95.3,64.8 96,64.8 | v10,58.5 12.25,58.5 15.75,58.5 22.25,58.5 25.75,58.5 32.25,58.5 35.75,58.5 42.25,58.5 45.75,58.5 52.25,58.5 55.75,58.5 62.25,58.5 65.75,58.5 72.25,58.5 75.75,58.5 82.25,58.5 85.75,58.5 91.6,58.5 95.3,54.8 96,54.8 | v10,48.5 12.25,48.5 15.75,48.5 22.25,48.5 25.75,48.5 32.25,48.5 35.75,48.5 42.25,48.5 45.75,48.5 52.25,48.5 55.75,48.5 62.25,48.5 65.75,48.5 72.25,48.5 75.75,48.5 82.25,48.5 85.75,48.5 91.6,48.5 95.3,44.8 96,44.8 | v10,38.5 12.25,38.5 15.75,38.5 22.25,38.5 25.75,38.5 32.25,38.5 35.75,38.5 42.25,38.5 45.75,38.5 52.25,38.5 55.75,38.5 62.25,38.5 65.75,38.5 72.25,38.5 75.75,38.5 82.25,38.5 85.75,38.5 91.6,38.5 95.3,34.8 96,34.8 | v10,28.5 12.25,28.5 15.75,28.5 22.25,28.5 25.75,28.5 32.25,28.5 35.75,28.5 42.25,28.5 45.75,28.5 52.25,28.5 55.75,28.5 62.25,28.5 65.75,28.5 72.25,28.5 75.75,28.5 82.25,28.5 85.75,28.5 91.6,28.5 95.3,24.8 96,24.8 | v10,18.5 12.25,18.5 15.75,18.5 22.25,18.5 25.75,18.5 32.25,18.5 35.75,18.5 42.25,18.5 45.75,18.5 52.25,18.5 55.75,18.5 62.25,18.5 65.75,18.5 72.25,18.5 75.75,18.5 82.25,18.5 85.75,18.5 91.6,18.5 95.3,14.8 96,14.8
  Top 0.406: CN1.5 121.09,52 v117,52 | v117,63.8 U9.5 119.95,63.17 120.6,62.52 C194.1
  Bottom 0.203: v108.8,89.5 112,89.5 113.3,88.2 113.3,85.5 114,84.8 v115.2,84.8 | v108.8,79.5 112,79.5 113.3,78.2 113.3,75.5 114,74.8 v115.2,74.8 | v108.8,69.5 112,69.5 113.3,68.2 113.3,65.5 114,64.8 v115.2,64.8 | v108.8,59.5 112,59.5 113.3,58.2 113.3,55.5 114,54.8 v115.2,54.8 | v108.8,49.5 112,49.5 113.3,48.2 113.3,45.5 114,44.8 v115.2,44.8 | v108.8,39.5 112,39.5 113.3,38.2 113.3,35.5 114,34.8 v115.2,34.8 | v108.8,29.5 112,29.5 113.3,28.2 113.3,25.5 114,24.8 v115.2,24.8 | v108.8,19.5 112,19.5 113.3,18.2 113.3,15.5 114,14.8 v115.2,14.8
  Bottom 0.254: v115.2,24.8 115.22,24.82 | v115.2,34.8 | v115.2,44.8 v115.21,44.81 | v115.2,54.8 115.21,54.81 | v115.2,64.8 v115.21,64.8 | v115.2,74.8 | v115.2,14.8 v115.2,14.81
  Bottom 0.406: 117,74.8 117,83.98 116.18,84.8 v115.2,84.8 | 117,74.8 117,64.8 | 117,64.8 117,64.31 v117,63.8 117,54.81 | 117,54.81 v117,52 117,44.81 | 117,44.81 117,34.8 | 117,34.8 117,24.82 | 117,24.82 117,14.81 | 117,14.81 117,10.5 116,9.5 11,9.5 10,10.5 v10,18.5 v10,28.5 v10,38.5 v10,48.5 v10,58.5 v10,68.5 v10,78.5 v10,88.5 | 115.22,24.82 117,24.82 | v115.2,34.8 117,34.8 | v115.21,44.81 117,44.81 | 115.21,54.81 117,54.81 | v115.21,64.8 117,64.8 | v115.2,74.8 117,74.8 | v115.2,14.81 117,14.81
5V
  Top 0.203: SJ1.1 120.3,53.5 CN1.6
  Top 0.406: U9.3 123.55,65.7 124.25,65 124.25,63.75 | 124.25,63.75 124.25,59.38 123.12,58.25 CN1.6 | U9.1 124.2,63.8 124.25,63.75
GND  (via drill 0.33)
  Top 0.178: 102.15,81.32 102.15,81.37 | 102.15,71.32 102.15,71.37 | 102.15,61.32 102.15,61.37 | 102.15,51.32 102.15,51.37 | 102.15,41.32 102.15,41.37 | 102.15,31.32 102.15,31.37 | 102.15,21.32 102.15,21.37 | 102.15,11.32 102.15,11.37
  Top 0.203: M11.11 v17.47,85.24 | v17.47,86.61 v17.48,86.6 C1.2 19.65,86.6 20.5,85.75 20.5,80 | M11.9 16.78,84.25 17.19,83.84 v17.47,83.84 | M12.11 v27.47,85.24 | v27.47,86.61 v27.48,86.6 C4.2 29.65,86.6 30.5,85.75 30.5,80 | M12.9 26.78,84.25 27.19,83.84 v27.47,83.84 | M13.11 v37.47,85.24 | v37.47,86.61 v37.48,86.6 C7.2 39.65,86.6 40.5,85.75 40.5,80 | M13.9 36.78,84.25 37.19,83.84 v37.47,83.84 | M14.11 v47.47,85.24 | v47.47,86.61 v47.48,86.6 C10.2 49.65,86.6 50.5,85.75 50.5,80 | M14.9 46.78,84.25 47.19,83.84 v47.47,83.84 | M15.11 v57.47,85.24 | v57.47,86.61 v57.48,86.6 C13.2 59.65,86.6 60.5,85.75 60.5,80 | M15.9 56.78,84.25 57.19,83.84 v57.47,83.84 | M16.11 v67.47,85.24 | v67.47,86.61 v67.48,86.6 C16.2 69.65,86.6 70.5,85.75 70.5,80 | M16.9 66.78,84.25 67.19,83.84 v67.47,83.84 | M17.11 v77.47,85.24 | v77.47,86.61 v77.48,86.6 C19.2 79.65,86.6 80.5,85.75 80.5,80 | M17.9 76.78,84.25 77.19,83.84 v77.47,83.84 | M18.11 v87.47,85.24 | v87.47,86.61 v87.48,86.6 C22.2 89.65,86.6 90.5,85.75 90.5,80 | M18.9 86.78,84.25 87.19,83.84 v87.47,83.84 | C3.2 13.65,80.1 13.75,80 | C6.2 23.65,80.1 23.75,80 | C9.2 33.65,80.1 33.75,80 | C12.2 43.65,80.1 43.75,80 | C15.2 53.65,80.1 53.75,80 | C18.2 63.65,80.1 63.75,80 | C21.2 73.65,80.1 73.75,80 | C24.2 83.65,80.1 83.75,80 | M21.11 v17.47,75.24 | v17.47,76.61 v17.48,76.6 C25.2 19.65,76.6 20.5,75.75 20.5,70 | M21.9 16.78,74.25 17.19,73.84 v17.47,73.84 | M22.11 v27.47,75.24 | v27.47,76.61 v27.48,76.6 C28.2 29.65,76.6 30.5,75.75 30.5,70 | M22.9 26.78,74.25 27.19,73.84 v27.47,73.84 | M23.11 v37.47,75.24 | v37.47,76.61 v37.48,76.6 C31.2 39.65,76.6 40.5,75.75 40.5,70 | M23.9 36.78,74.25 37.19,73.84 v37.47,73.84
  Top 0.203: M24.11 v47.47,75.24 | v47.47,76.61 v47.48,76.6 C34.2 49.65,76.6 50.5,75.75 50.5,70 | M24.9 46.78,74.25 47.19,73.84 v47.47,73.84 | M25.11 v57.47,75.24 | v57.47,76.61 v57.48,76.6 C37.2 59.65,76.6 60.5,75.75 60.5,70 | M25.9 56.78,74.25 57.19,73.84 v57.47,73.84 | M26.11 v67.47,75.24 | v67.47,76.61 v67.48,76.6 C40.2 69.65,76.6 70.5,75.75 70.5,70 | M26.9 66.78,74.25 67.19,73.84 v67.47,73.84 | M27.11 v77.47,75.24 | v77.47,76.61 v77.48,76.6 C43.2 79.65,76.6 80.5,75.75 80.5,70 | M27.9 76.78,74.25 77.19,73.84 v77.47,73.84 | M28.11 v87.47,75.24 | v87.47,76.61 v87.48,76.6 C46.2 89.65,76.6 90.5,75.75 90.5,70 | M28.9 86.78,74.25 87.19,73.84 v87.47,73.84 | C27.2 13.65,70.1 13.75,70 | C30.2 23.65,70.1 23.75,70 | C33.2 33.65,70.1 33.75,70 | C36.2 43.65,70.1 43.75,70 | C39.2 53.65,70.1 53.75,70 | C42.2 63.65,70.1 63.75,70 | C45.2 73.65,70.1 73.75,70 | C48.2 83.65,70.1 83.75,70 | M31.11 v17.47,65.24 | v17.47,66.61 v17.48,66.6 C49.2 19.65,66.6 20.5,65.75 20.5,60 | M31.9 16.78,64.25 17.19,63.84 v17.47,63.84 | M32.11 v27.47,65.24 | v27.47,66.61 v27.48,66.6 C52.2 29.65,66.6 30.5,65.75 30.5,60 | M32.9 26.78,64.25 27.19,63.84 v27.47,63.84 | M33.11 v37.47,65.24 | v37.47,66.61 v37.48,66.6 C55.2 39.65,66.6 40.5,65.75 40.5,60 | M33.9 36.78,64.25 37.19,63.84 v37.47,63.84 | M34.11 v47.47,65.24 | v47.47,66.61 v47.48,66.6 C58.2 49.65,66.6 50.5,65.75 50.5,60 | M34.9 46.78,64.25 47.19,63.84 v47.47,63.84 | M35.11 v57.47,65.24 | v57.47,66.61 v57.48,66.6 C61.2 59.65,66.6 60.5,65.75 60.5,60 | M35.9 56.78,64.25 57.19,63.84 v57.47,63.84 | M36.11 v67.47,65.24 | v67.47,66.61 v67.48,66.6 C64.2 69.65,66.6 70.5,65.75 70.5,60 | M36.9 66.78,64.25 67.19,63.84 v67.47,63.84
  Top 0.203: M37.11 v77.47,65.24 | v77.47,66.61 v77.48,66.6 C67.2 79.65,66.6 80.5,65.75 80.5,60 | M37.9 76.78,64.25 77.19,63.84 v77.47,63.84 | M38.11 v87.47,65.24 | v87.47,66.61 v87.48,66.6 C70.2 89.65,66.6 90.5,65.75 90.5,60 | M38.9 86.78,64.25 87.19,63.84 v87.47,63.84 | C51.2 13.65,60.1 13.75,60 | C54.2 23.65,60.1 23.75,60 | C57.2 33.65,60.1 33.75,60 | C60.2 43.65,60.1 43.75,60 | C63.2 53.65,60.1 53.75,60 | C66.2 63.65,60.1 63.75,60 | C69.2 73.65,60.1 73.75,60 | C72.2 83.65,60.1 83.75,60 | M41.11 v17.47,55.24 | v17.47,56.61 v17.48,56.6 C73.2 19.65,56.6 20.5,55.75 20.5,50 | M41.9 16.78,54.25 17.19,53.84 v17.47,53.84 | M42.11 v27.47,55.24 | v27.47,56.61 v27.48,56.6 C76.2 29.65,56.6 30.5,55.75 30.5,50 | M42.9 26.78,54.25 27.19,53.84 v27.47,53.84 | M43.11 v37.47,55.24 | v37.47,56.61 v37.48,56.6 C79.2 39.65,56.6 40.5,55.75 40.5,50 | M43.9 36.78,54.25 37.19,53.84 v37.47,53.84 | M44.11 v47.47,55.24 | v47.47,56.61 v47.48,56.6 C82.2 49.65,56.6 50.5,55.75 50.5,50 | M44.9 46.78,54.25 47.19,53.84 v47.47,53.84 | M45.11 v57.47,55.24 | v57.47,56.61 v57.48,56.6 C85.2 59.65,56.6 60.5,55.75 60.5,50 | M45.9 56.78,54.25 57.19,53.84 v57.47,53.84 | M46.11 v67.47,55.24 | v67.47,56.61 v67.48,56.6 C88.2 69.65,56.6 70.5,55.75 70.5,50 | M46.9 66.78,54.25 67.19,53.84 v67.47,53.84 | M47.11 v77.47,55.24 | v77.47,56.61 v77.48,56.6 C91.2 79.65,56.6 80.5,55.75 80.5,50 | M47.9 76.78,54.25 77.19,53.84 v77.47,53.84 | M48.11 v87.47,55.24 | v87.47,56.61 v87.48,56.6 C94.2 89.65,56.6 90.5,55.75 90.5,50 | M48.9 86.78,54.25 87.19,53.84 v87.47,53.84 | C75.2 13.65,50.1 13.75,50 | C78.2 23.65,50.1 23.75,50 | C81.2 33.65,50.1 33.75,50 | C84.2 43.65,50.1 43.75,50
  Top 0.203: C87.2 53.65,50.1 53.75,50 | C90.2 63.65,50.1 63.75,50 | C93.2 73.65,50.1 73.75,50 | C96.2 83.65,50.1 83.75,50 | M51.11 v17.47,45.24 | v17.47,46.61 v17.48,46.6 C97.2 19.65,46.6 20.5,45.75 20.5,40 | M51.9 16.78,44.25 17.19,43.84 v17.47,43.84 | M52.11 v27.47,45.24 | v27.47,46.61 v27.48,46.6 C100.2 29.65,46.6 30.5,45.75 30.5,40 | M52.9 26.78,44.25 27.19,43.84 v27.47,43.84 | M53.11 v37.47,45.24 | v37.47,46.61 v37.48,46.6 C103.2 39.65,46.6 40.5,45.75 40.5,40 | M53.9 36.78,44.25 37.19,43.84 v37.47,43.84 | M54.11 v47.47,45.24 | v47.47,46.61 v47.48,46.6 C106.2 49.65,46.6 50.5,45.75 50.5,40 | M54.9 46.78,44.25 47.19,43.84 v47.47,43.84 | M55.11 v57.47,45.24 | v57.47,46.61 v57.48,46.6 C109.2 59.65,46.6 60.5,45.75 60.5,40 | M55.9 56.78,44.25 57.19,43.84 v57.47,43.84 | M56.11 v67.47,45.24 | v67.47,46.61 v67.48,46.6 C112.2 69.65,46.6 70.5,45.75 70.5,40 | M56.9 66.78,44.25 67.19,43.84 v67.47,43.84 | M57.11 v77.47,45.24 | v77.47,46.61 v77.48,46.6 C115.2 79.65,46.6 80.5,45.75 80.5,40 | M57.9 76.78,44.25 77.19,43.84 v77.47,43.84 | M58.11 v87.47,45.24 | v87.47,46.61 v87.48,46.6 C118.2 89.65,46.6 90.5,45.75 90.5,40 | M58.9 86.78,44.25 87.19,43.84 v87.47,43.84 | C99.2 13.65,40.1 13.75,40 | C102.2 23.65,40.1 23.75,40 | C105.2 33.65,40.1 33.75,40 | C108.2 43.65,40.1 43.75,40 | C111.2 53.65,40.1 53.75,40 | C114.2 63.65,40.1 63.75,40 | C117.2 73.65,40.1 73.75,40 | C120.2 83.65,40.1 83.75,40 | M61.11 v17.47,35.24 | v17.47,36.61 v17.48,36.6 C121.2 19.65,36.6 20.5,35.75 20.5,30 | M61.9 16.78,34.25 17.19,33.84 v17.47,33.84 | M62.11 v27.47,35.24 | v27.47,36.61 v27.48,36.6 C124.2 29.65,36.6 30.5,35.75 30.5,30 | M62.9 26.78,34.25 27.19,33.84 v27.47,33.84
  Top 0.203: M63.11 v37.47,35.24 | v37.47,36.61 v37.48,36.6 C127.2 39.65,36.6 40.5,35.75 40.5,30 | M63.9 36.78,34.25 37.19,33.84 v37.47,33.84 | M64.11 v47.47,35.24 | v47.47,36.61 v47.48,36.6 C130.2 49.65,36.6 50.5,35.75 50.5,30 | M64.9 46.78,34.25 47.19,33.84 v47.47,33.84 | M65.11 v57.47,35.24 | v57.47,36.61 v57.48,36.6 C133.2 59.65,36.6 60.5,35.75 60.5,30 | M65.9 56.78,34.25 57.19,33.84 v57.47,33.84 | M66.11 v67.47,35.24 | v67.47,36.61 v67.48,36.6 C136.2 69.65,36.6 70.5,35.75 70.5,30 | M66.9 66.78,34.25 67.19,33.84 v67.47,33.84 | M67.11 v77.47,35.24 | v77.47,36.61 v77.48,36.6 C139.2 79.65,36.6 80.5,35.75 80.5,30 | M67.9 76.78,34.25 77.19,33.84 v77.47,33.84 | M68.11 v87.47,35.24 | v87.47,36.61 v87.48,36.6 C142.2 89.65,36.6 90.5,35.75 90.5,30 | M68.9 86.78,34.25 87.19,33.84 v87.47,33.84 | C123.2 13.65,30.1 13.75,30 | C126.2 23.65,30.1 23.75,30 | C129.2 33.65,30.1 33.75,30 | C132.2 43.65,30.1 43.75,30 | C135.2 53.65,30.1 53.75,30 | C138.2 63.65,30.1 63.75,30 | C141.2 73.65,30.1 73.75,30 | C144.2 83.65,30.1 83.75,30 | M71.11 v17.47,25.24 | v17.47,26.61 v17.48,26.6 C145.2 19.65,26.6 20.5,25.75 20.5,20 | M71.9 16.78,24.25 17.19,23.84 v17.47,23.84 | M72.11 v27.47,25.24 | v27.47,26.61 v27.48,26.6 C148.2 29.65,26.6 30.5,25.75 30.5,20 | M72.9 26.78,24.25 27.19,23.84 v27.47,23.84 | M73.11 v37.47,25.24 | v37.47,26.61 v37.48,26.6 C151.2 39.65,26.6 40.5,25.75 40.5,20 | M73.9 36.78,24.25 37.19,23.84 v37.47,23.84 | M74.11 v47.47,25.24 | v47.47,26.61 v47.48,26.6 C154.2 49.65,26.6 50.5,25.75 50.5,20 | M74.9 46.78,24.25 47.19,23.84 v47.47,23.84 | M75.11 v57.47,25.24 | v57.47,26.61 v57.48,26.6 C157.2 59.65,26.6 60.5,25.75 60.5,20
  Top 0.203: M75.9 56.78,24.25 57.19,23.84 v57.47,23.84 | M76.11 v67.47,25.24 | v67.47,26.61 v67.48,26.6 C160.2 69.65,26.6 70.5,25.75 70.5,20 | M76.9 66.78,24.25 67.19,23.84 v67.47,23.84 | M77.11 v77.47,25.24 | v77.47,26.61 v77.48,26.6 C163.2 79.65,26.6 80.5,25.75 80.5,20 | M77.9 76.78,24.25 77.19,23.84 v77.47,23.84 | M78.11 v87.47,25.24 | v87.47,26.61 v87.48,26.6 C166.2 89.65,26.6 90.5,25.75 90.5,20 | M78.9 86.78,24.25 87.19,23.84 v87.47,23.84 | C147.2 13.65,20.1 13.75,20 | C150.2 23.65,20.1 23.75,20 | C153.2 33.65,20.1 33.75,20 | C156.2 43.65,20.1 43.75,20 | C159.2 53.65,20.1 53.75,20 | C162.2 63.65,20.1 63.75,20 | C165.2 73.65,20.1 73.75,20 | C168.2 83.65,20.1 83.75,20 | M81.11 v17.47,15.24 | v17.47,16.61 v17.48,16.6 C169.2 19.65,16.6 20.5,15.75 20.5,10 | M81.9 16.78,14.25 17.19,13.85 v17.47,13.85 | M82.11 v27.47,15.24 | v27.47,16.61 v27.48,16.6 C172.2 29.65,16.6 30.5,15.75 30.5,10 | M82.9 26.78,14.25 27.19,13.85 v27.47,13.85 | M83.11 v37.47,15.24 | v37.47,16.61 v37.48,16.6 C175.2 39.65,16.6 40.5,15.75 40.5,10 | M83.9 36.78,14.25 37.19,13.85 v37.47,13.85 | M84.11 v47.47,15.24 | v47.47,16.61 v47.48,16.6 C178.2 49.65,16.6 50.5,15.75 50.5,10 | M84.9 46.78,14.25 47.19,13.85 v47.47,13.85 | M85.11 v57.47,15.24 | v57.47,16.61 v57.48,16.6 C181.2 59.65,16.6 60.5,15.75 60.5,10 | M85.9 56.78,14.25 57.19,13.85 v57.47,13.85 | M86.11 v67.47,15.24 | v67.47,16.61 v67.48,16.6 C184.2 69.65,16.6 70.5,15.75 70.5,10 | M86.9 66.78,14.25 67.19,13.85 v67.47,13.85 | M87.11 v77.47,15.24 | v77.47,16.61 v77.48,16.6 C187.2 79.65,16.6 80.5,15.75 80.5,10 | M87.9 76.78,14.25 77.19,13.85 v77.47,13.85 | M88.11 v87.47,15.24 | v87.47,16.61 v87.48,16.6 C190.2 89.65,16.6 90.5,15.75 90.5,10
  Top 0.203: M88.9 86.78,14.25 87.19,13.85 v87.47,13.85 | C171.2 13.65,10.1 13.75,10 | C174.2 23.65,10.1 23.75,10 | C177.2 33.65,10.1 33.75,10 | C180.2 43.65,10.1 43.75,10 | C183.2 53.65,10.1 53.75,10 | C186.2 63.65,10.1 63.75,10 | C189.2 73.65,10.1 73.75,10 | C192.2 83.65,10.1 83.75,10 | U1.21 106.81,86.62 106.59,86.41 106.59,80.6 | U2.21 106.77,76.62 106.59,76.45 106.59,70.6 | U2.2 103.62,77.92 104.82,79.12 104.82,80.6 | U3.21 106.72,66.62 106.59,66.5 106.59,60.6 | U3.1 103.87,68.58 104.82,69.52 104.82,70.6 | U4.21 106.86,56.62 106.59,56.36 106.59,50.6 | U5.2 U5.1 103.96,48.58 104.82,49.43 104.82,50.6 | U6.2 103.62,37.92 104.82,39.12 104.82,40.6 | U7.1 104.23,28.57 104.82,29.16 104.82,30.6 | v118,91 106,91 103.58,88.58 U1.1 U1.2
  Top 0.254: v118,81 117.6,80.6 106.59,80.6 104.82,80.6 104.2,80.6 103.38,81.42 U1.12 102.15,81.37 | v118,71 117.6,70.6 106.59,70.6 104.82,70.6 104.2,70.6 103.38,71.42 U2.12 102.15,71.37 | v118,61 117.6,60.6 106.59,60.6 104.2,60.6 103.38,61.42 U3.12 102.15,61.37 | v118,51 117.6,50.6 106.59,50.6 104.82,50.6 104.2,50.6 103.38,51.42 U4.12 102.15,51.37 | v118,41 117.6,40.6 104.82,40.6 104.2,40.6 103.38,41.42 U5.12 102.15,41.37 | v118,31 117.6,30.6 104.82,30.6 104.2,30.6 103.38,31.43 U6.12 102.15,31.37 | v118,21 117.6,20.6 104.2,20.6 103.38,21.43 U7.12 102.15,21.37 | v118,11 117.6,10.6 104.2,10.6 103.38,11.43 U8.12 102.15,11.37
  Top 0.406: 10,80 13.75,80 20.5,80 23.75,80 30.5,80 33.75,80 40.5,80 43.75,80 50.5,80 53.75,80 60.5,80 63.75,80 70.5,80 73.75,80 80.5,80 83.75,80 90.5,80 101.25,80 102.15,80.9 102.15,81.32 | 10,70 13.75,70 20.5,70 23.75,70 30.5,70 33.75,70 40.5,70 43.75,70 50.5,70 53.75,70 60.5,70 63.75,70 70.5,70 73.75,70 80.5,70 83.75,70 90.5,70 101.25,70 102.15,70.9 102.15,71.32 | 10,60 13.75,60 20.5,60 23.75,60 30.5,60 33.75,60 40.5,60 43.75,60 50.5,60 53.75,60 60.5,60 63.75,60 70.5,60 73.75,60 80.5,60 83.75,60 90.5,60 101.25,60 102.15,60.9 102.15,61.32 | 10,50 13.75,50 20.5,50 23.75,50 30.5,50 33.75,50 40.5,50 43.75,50 50.5,50 53.75,50 60.5,50 63.75,50 70.5,50 73.75,50 80.5,50 83.75,50 90.5,50 101.25,50 102.15,50.9 102.15,51.32 | 10,40 13.75,40 20.5,40 23.75,40 30.5,40 33.75,40 40.5,40 43.75,40 50.5,40 53.75,40 60.5,40 63.75,40 70.5,40 73.75,40 80.5,40 83.75,40 90.5,40 101.25,40 102.15,40.9 102.15,41.32 | 10,30 13.75,30 20.5,30 23.75,30 30.5,30 33.75,30 40.5,30 43.75,30 50.5,30 53.75,30 60.5,30 63.75,30 70.5,30 73.75,30 80.5,30 83.75,30 90.5,30 101.25,30 102.15,30.9 102.15,31.32 | 10,20 13.75,20 20.5,20 23.75,20 30.5,20 33.75,20 40.5,20 43.75,20 50.5,20 53.75,20 60.5,20 63.75,20 70.5,20 73.75,20 80.5,20 83.75,20 90.5,20 101.25,20 102.15,20.9 102.15,21.32 | 10,10 13.75,10 20.5,10 23.75,10 30.5,10 33.75,10 40.5,10 43.75,10 50.5,10 53.75,10 60.5,10 63.75,10 70.5,10 73.75,10 80.5,10 83.75,10 90.5,10 101.25,10 102.15,10.9 102.15,11.32 | CN1.1 v118,43.61 | U9.2 121.25,64.75 | 121.25,64.75 v118,64.75 | C193.2 121.9,66.9 121.25,66.25 121.25,64.75
  Top 0.406: C194.2 121.9,62.6 121.25,63.25 121.25,64.75
  Bottom 0.203: v17.47,86.61 v17.47,85.24 v17.47,83.84 | v27.47,86.61 v27.47,85.24 v27.47,83.84 | v37.47,86.61 v37.47,85.24 v37.47,83.84 | v47.47,86.61 v47.47,85.24 v47.47,83.84 | v57.47,86.61 v57.47,85.24 v57.47,83.84 | v67.47,86.61 v67.47,85.24 v67.47,83.84 | v77.47,86.61 v77.47,85.24 v77.47,83.84 | v87.47,86.61 v87.47,85.24 v87.47,83.84 | v17.47,76.61 v17.47,75.24 v17.47,73.84 | v27.47,76.61 v27.47,75.24 v27.47,73.84 | v37.47,76.61 v37.47,75.24 v37.47,73.84 | v47.47,76.61 v47.47,75.24 v47.47,73.84 | v57.47,76.61 v57.47,75.24 v57.47,73.84 | v67.47,76.61 v67.47,75.24 v67.47,73.84 | v77.47,76.61 v77.47,75.24 v77.47,73.84 | v87.47,76.61 v87.47,75.24 v87.47,73.84 | v17.47,66.61 v17.47,65.24 v17.47,63.84 | v27.47,66.61 v27.47,65.24 v27.47,63.84 | v37.47,66.61 v37.47,65.24 v37.47,63.84 | v47.47,66.61 v47.47,65.24 v47.47,63.84 | v57.47,66.61 v57.47,65.24 v57.47,63.84 | v67.47,66.61 v67.47,65.24 v67.47,63.84 | v77.47,66.61 v77.47,65.24 v77.47,63.84 | v87.47,66.61 v87.47,65.24 v87.47,63.84 | v17.47,56.61 v17.47,55.24 v17.47,53.84 | v27.47,56.61 v27.47,55.24 v27.47,53.84 | v37.47,56.61 v37.47,55.24 v37.47,53.84 | v47.47,56.61 v47.47,55.24 v47.47,53.84 | v57.47,56.61 v57.47,55.24 v57.47,53.84 | v67.47,56.61 v67.47,55.24 v67.47,53.84 | v77.47,56.61 v77.47,55.24 v77.47,53.84 | v87.47,56.61 v87.47,55.24 v87.47,53.84 | v17.47,46.61 v17.47,45.24 v17.47,43.84 | v27.47,46.61 v27.47,45.24 v27.47,43.84 | v37.47,46.61 v37.47,45.24 v37.47,43.84 | v47.47,46.61 v47.47,45.24 v47.47,43.84 | v57.47,46.61 v57.47,45.24 v57.47,43.84 | v67.47,46.61 v67.47,45.24 v67.47,43.84 | v77.47,46.61 v77.47,45.24 v77.47,43.84 | v87.47,46.61 v87.47,45.24 v87.47,43.84